# Altium project Steering_Unit_ECU.PrjPcb (part 1 of 2)
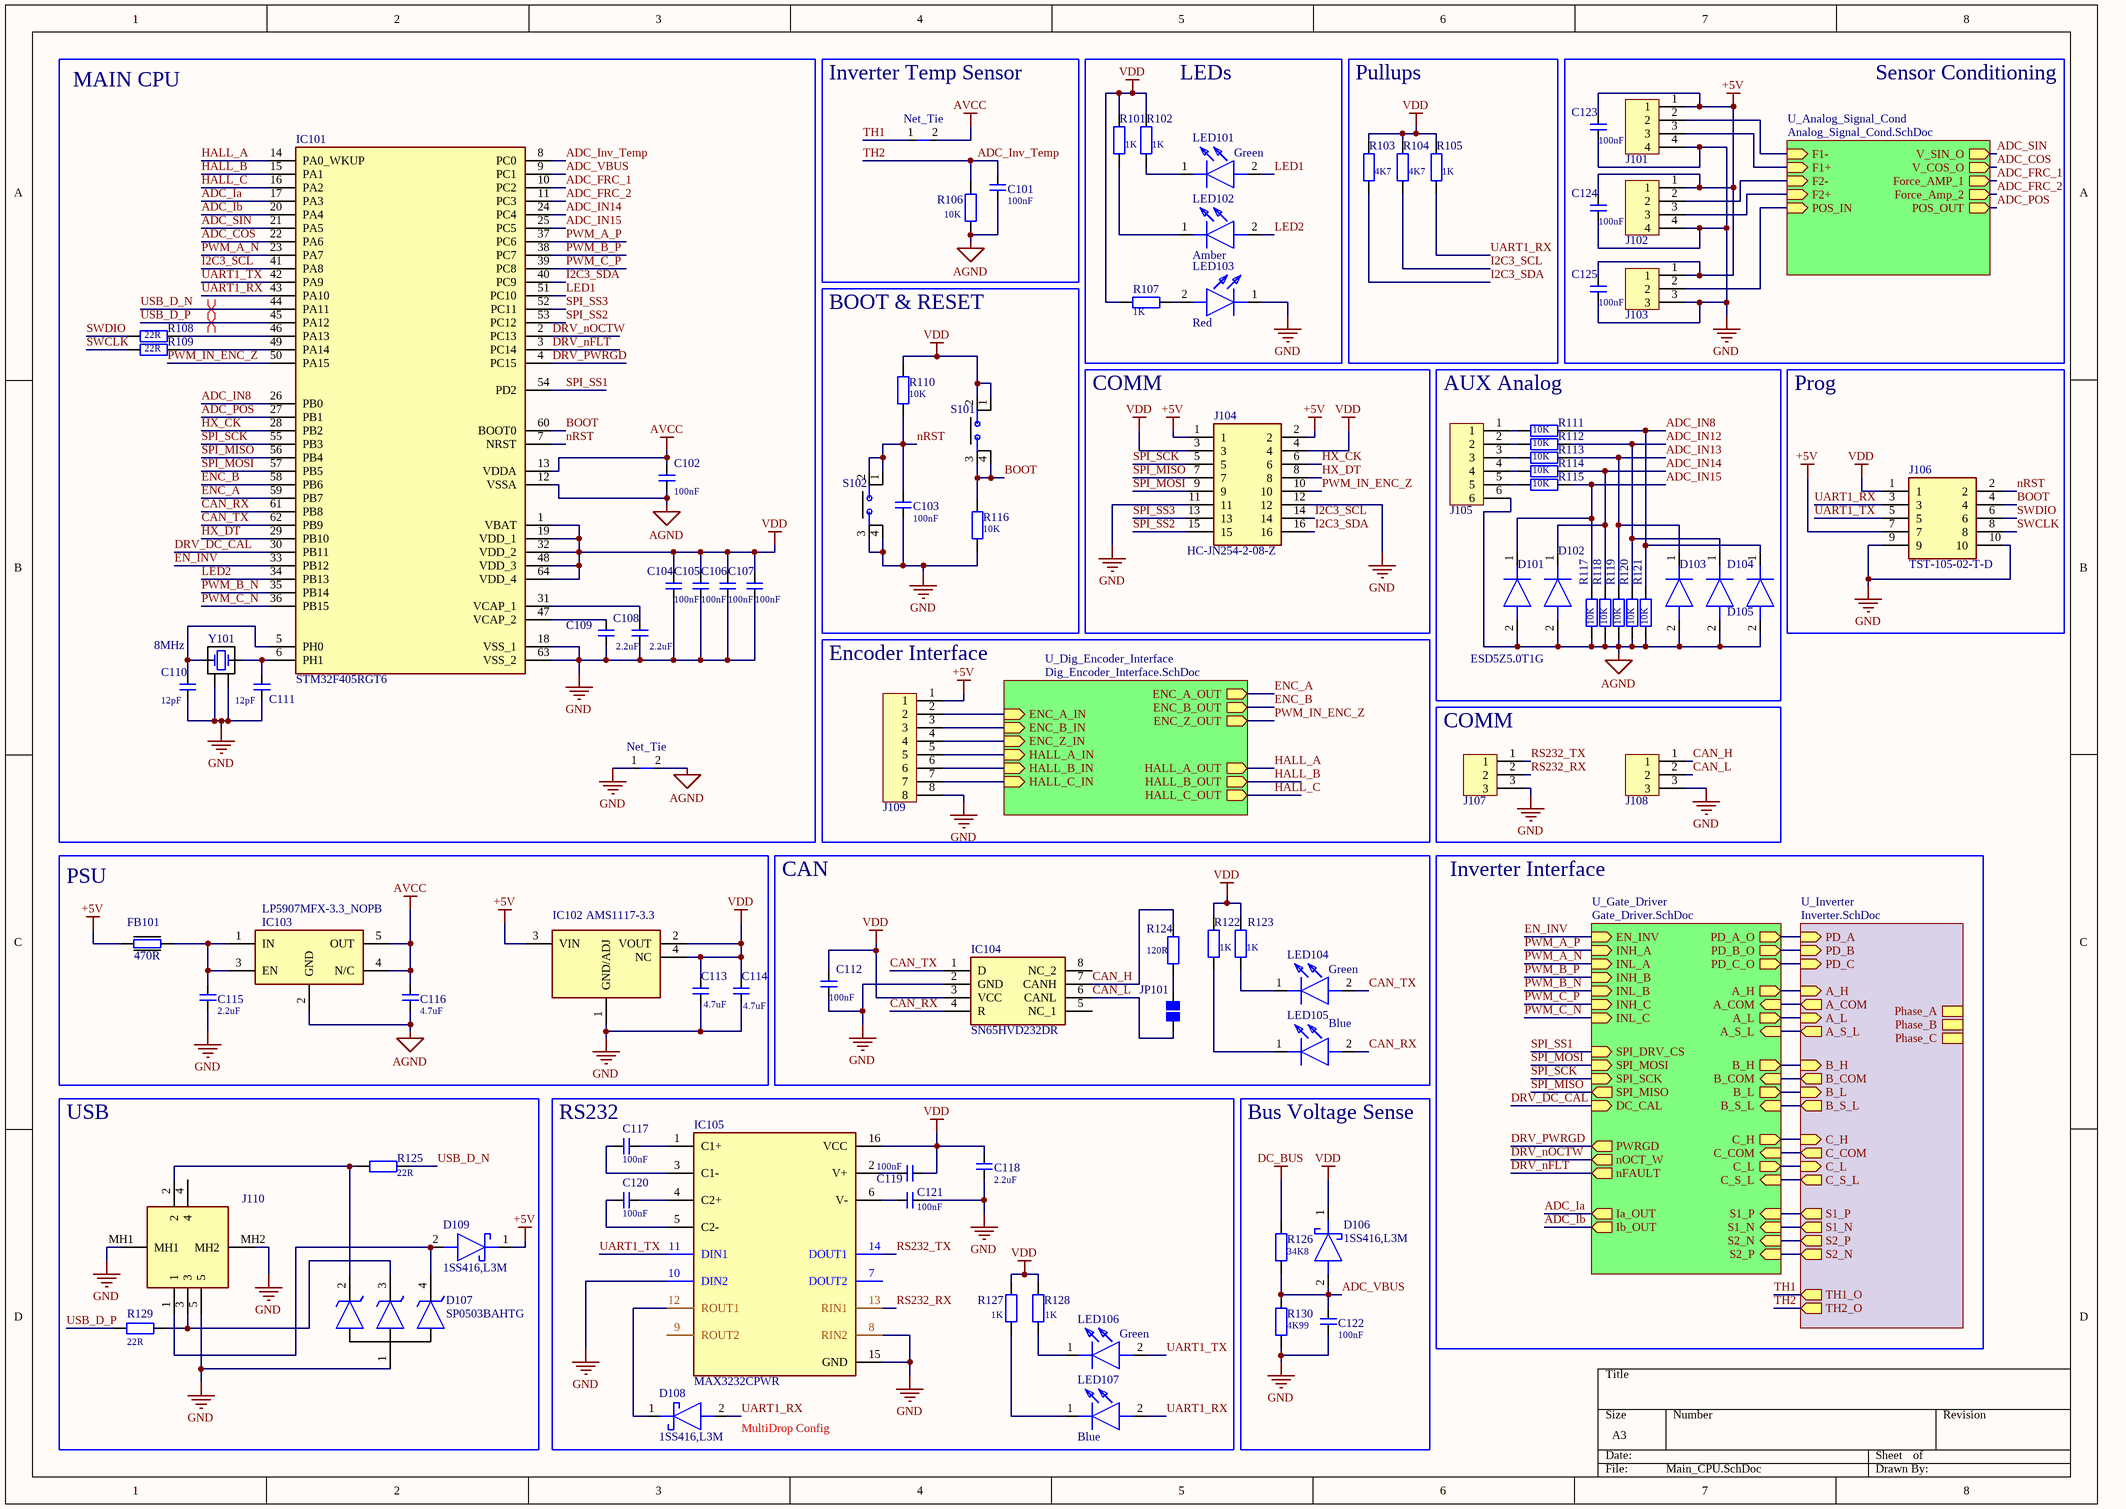
[diagram p0: Main_CPU.SchDoc]
5 sheets, 237 parts. Net scope: hierarchical (ports join the sheet entries above them; power ports are global).
Board file: ECU_Board.PcbDoc
Sheets:
  Main_CPU.SchDoc
    U_Gate_Driver = Gate_Driver.SchDoc
    U_Inverter = Inverter.SchDoc
    U_Dig_Encoder_Interface = Dig_Encoder_Interface.SchDoc
    U_Analog_Signal_Cond = Analog_Signal_Cond.SchDoc

## Sheet Main_CPU.SchDoc
size A3; DrawnBy: R.R.Sorial; SheetNumber: 1; SheetTotal: 5

### Parts
C101  value 100nF  [CAPC1005X06N]  (hidden comment: Cap)
C102  value 100nF  [CAPC1005X06N]  (hidden comment: Cap)
C103  value 100nF  [CAPC1005X06N]  (hidden comment: Cap)
C104  value 100nF  [CAPC1005X06N]  (hidden comment: Cap)
C105  value 100nF  [CAPC1005X06N]  (hidden comment: Cap)
C106  value 100nF  [CAPC1005X06N]  (hidden comment: Cap)
C107  value 100nF  [CAPC1005X06N]  (hidden comment: Cap)
C108  value 2.2uF  [CAPC1005X06N]  (hidden comment: Cap)
C109  value 2.2uF  [CAPC1005X06N]  (hidden comment: Cap)
C110  value 12pF  [CAPC1005X06N]  (hidden comment: Cap)
C111  value 12pF  [CAPC1005X06N]  (hidden comment: Cap)
C112  value 100nF  [CAPC1005X06N]  (hidden comment: Cap)
C113  value 4.7uF  [CAPC3225X17N]  (hidden comment: Cap)
C114  value 4.7uF  [CAPC3225X17N]  (hidden comment: Cap)
C115  value 2.2uF  [CAPC1005X06N]  (hidden comment: Cap)
C116  value 4.7uF  [CAPC3225X17N]  (hidden comment: Cap)
C117  value 100nF  [CAPC1005X06N]  (hidden comment: Cap)
C118  value 2.2uF  [CAPC1005X06N]  (hidden comment: Cap)
C119  value 100nF  [CAPC1005X06N]  (hidden comment: Cap)
C120  value 100nF  [CAPC1005X06N]  (hidden comment: Cap)
C121  value 100nF  [CAPC1005X06N]  (hidden comment: Cap)
C122  value 100nF  [CAPC1005X06N]  (hidden comment: Cap)
C123  value 100nF  [CAPC1005X06N]  (hidden comment: Cap)
C124  value 100nF  [CAPC1005X06N]  (hidden comment: Cap)
C125  value 100nF  [CAPC1005X06N]  (hidden comment: Cap)
D101  ESD5Z5.0T1G  [SODFL1608X70N]
D102  ESD5Z5.0T1G  [SODFL1608X70N]  (value not drawn)
D103  ESD5Z5.0T1G  [SODFL1608X70N]  (value not drawn)
D104  ESD5Z5.0T1G  [SODFL1608X70N]  (value not drawn)
D105  ESD5Z5.0T1G  [SODFL1608X70N]  (value not drawn)
D106  1SS416,L3M  [SODFL1006X45N]
D107  SP0503BAHTG  [SP0503BAHTG]
D108  1SS416,L3M  [SODFL1006X45N]
D109  1SS416,L3M  [SODFL1006X45N]
FB101  value 470R  [BLM18SP221SN1B]  (hidden comment: 470 OHM)
IC101  STM32F405RGT6  [QFP50P1200X1200X160-64N]
IC102  AMS1117-3.3  [SOT229P700X180-4N]
IC103  LP5907MFX-3.3_NOPB  [SOT95P280X145-5N]
IC104  SN65HVD232DR  [SOIC127P600X175-8N]
IC105  MAX3232CPWR  [SOP65P640X120-16N]
J101  XH2_54_4p  [XH2.54-4P]  (value not drawn)
J102  XH2_54_4p  [XH2.54-4P]  (value not drawn)
J103  XH2_54_3p  [XH2.54-3P]  (value not drawn)
J104  MPN: HC-JN254-2-08-Z  [SHDR16W64P254_2X8_2794X927X940P]  (hidden comment: TST-108-02-T-D)
J105  PCB_Conn_6P  [PCB_CONN_6]  (value not drawn)  (no BOM)
J106  TST-105-02-T-D  [TST-105-XX-Y-D]
J107  XH2_54_3p  [XH2.54-3P]  (value not drawn)
J108  XH2_54_3p  [XH2.54-3P]  (value not drawn)
J109  PCB_Conn_8p  [PCB_CONN_8]  (value not drawn)  (no BOM)
J110  10119313-301TLF  [10119313301TLF]  (value not drawn)
JP101  Jumper  [Jumper]  (value not drawn)  (no BOM)
LED101  Green  [LEDC1608X80N]
LED102  Amber  [LEDC1608X80N]
LED103  Red  [LEDC1608X80N]
LED104  Green  [LEDC1608X80N]
LED105  Blue  [LEDC1608X80N]
LED106  Green  [LEDC1608X80N]
LED107  Blue  [LEDC1608X80N]
NT101  Net_Tie  [Net_Tie_SMD]  (net tie, no BOM)
NT102  Net_Tie  [Net_Tie_SMD]  (net tie, no BOM)
R101  value 1K  [RESC1005X04N]  (hidden comment: R)
R102  value 1K  [RESC1005X04N]  (hidden comment: R)
R103  value 4K7  [RESC1005X04N]  (hidden comment: R)
R104  value 4K7  [RESC1005X04N]  (hidden comment: R)
R105  value 1K  [RESC1005X04N]  (hidden comment: R)
R106  value 10K  [RESC1005X04N]  (hidden comment: R)
R107  value 1K  [RESC1005X04N]  (hidden comment: R)
R108  value 22R  [RESC1005X04N]  (hidden comment: R)
R109  value 22R  [RESC1005X04N]  (hidden comment: R)
R110  value 10K  [RESC1005X04N]  (hidden comment: R)
R111  value 10K  [RESC1005X04N]  (hidden comment: R)
R112  value 10K  [RESC1005X04N]  (hidden comment: R)
R113  value 10K  [RESC1005X04N]  (hidden comment: R)
R114  value 10K  [RESC1005X04N]  (hidden comment: R)
R115  value 10K  [RESC1005X04N]  (hidden comment: R)
R116  value 10K  [RESC1005X04N]  (hidden comment: R)
R117  value 10K  [RESC1005X04N]  (hidden comment: R)
R118  value 10K  [RESC1005X04N]  (hidden comment: R)
R119  value 10K  [RESC1005X04N]  (hidden comment: R)
R120  value 10K  [RESC1005X04N]  (hidden comment: R)
R121  value 10K  [RESC1005X04N]  (hidden comment: R)
R122  value 1K  [RESC1005X04N]  (hidden comment: R)
R123  value 1K  [RESC1005X04N]  (hidden comment: R)
R124  value 120R  [RESC3216X06N]  (hidden comment: R)
R125  value 22R  [RESC1005X04N]  (hidden comment: R)
R126  value 34K8  [RESC1005X04N]  (hidden comment: R)
R127  value 1K  [RESC1005X04N]  (hidden comment: R)
R128  value 1K  [RESC1005X04N]  (hidden comment: R)
R129  value 22R  [RESC1005X04N]  (hidden comment: R)
R130  value 4K99  [RESC1005X04N]  (hidden comment: R)
S101  TS18-5-25-SL-260-SMT-TR  [TS18525SL260SMTTR]  (value not drawn)
S102  TS18-5-25-SL-260-SMT-TR  [TS18525SL260SMTTR]  (value not drawn)
Y101  value 8MHz  [830105863709]

### Blocks framed on the sheet
MAIN CPU: C102 C104-C111 IC101 NT101 R108 R109 Y101
Inverter Temp Sensor: C101 NT102 R106
LEDs: LED101-LED103 R101 R102 R107
Pullups: R103-R105
Sensor Conditioning: C123-C125 J101-J103
BOOT & RESET: C103 R110 R116 S101 S102
COMM: J104
AUX Analog: D101-D105 J105 R111-R115 R117-R121
Prog: J106
Encoder Interface: J109
COMM: J107 J108
PSU: C113-C116 FB101 IC102 IC103
CAN: C112 IC104 JP101 LED104 LED105 R122-R124
USB: D107 D109 J110 R125 R129
RS232: C117-C121 D108 IC105 LED106 LED107 R127 R128
Bus Voltage Sense: C122 D106 R126 R130

### Sub-sheets
U_Analog_Signal_Cond = Analog_Signal_Cond.SchDoc: V_SIN_O (out), V_COS_O (out), Force_AMP_1 (out), Force_Amp_2 (out), POS_OUT (out), F1- (in), F1+ (in), F2- (in), F2+ (in), POS_IN (in)
U_Dig_Encoder_Interface = Dig_Encoder_Interface.SchDoc: ENC_A_OUT (out), ENC_B_OUT (out), ENC_Z_OUT (out), HALL_A_OUT (out), HALL_B_OUT (out), HALL_C_OUT (out), ENC_A_IN (in), ENC_B_IN (in), ENC_Z_IN (in), HALL_A_IN (in), HALL_B_IN (in), HALL_C_IN (in)
U_Gate_Driver = Gate_Driver.SchDoc: EN_INV (in), INH_A (in), INL_A (in), INH_B (in), INL_B (in), INH_C (in), INL_C (in), SPI_DRV_CS (in), SPI_MISO (out), SPI_MOSI (in), SPI_SCK (in), DC_CAL (in), nOCT_W (out), nFAULT (out), S1_N (in), S1_P (in), S2_N (in), S2_P (in), A_H (out), A_L (out), A_COM (in), A_S_L (in), B_H (out), B_L (out), B_COM (in), B_S_L (in), C_H (out), C_L (out), C_COM (in), C_S_L (in), PWRGD (out), Ia_OUT (out), Ib_OUT (out), PD_A_O (out), PD_B_O (out), PD_C_O (out)
U_Inverter = Inverter.SchDoc: Phase_A, Phase_B, Phase_C, S1_P (out), S1_N (out), A_H (in), A_COM (out), A_L (in), A_S_L (out), S2_P (out), S2_N (out), B_H (in), B_COM (out), B_L (in), B_S_L (out), TH1_O (out), TH2_O (out), C_S_L (out), C_H (in), C_COM (out), C_L (in), PD_C (in), PD_A (in), PD_B (in)

### Nets
+5V: C123.2 C124.2 C125.2 D109.1(K) FB101.1 IC102.3(VIN) J101.1 J102.1 J103.1 J104.1 J104.2 J106.7 J109.1
AGND: C101.1 C102.1 C116.1 D101.2(A) D102.2(A) D103.2(A) D104.2(A) D105.2(A) IC101.12(VSSA) IC103.2(GND) J105.6 NT101.2 R106.1 R117.2 R118.2 R119.2 R120.2 R121.2
AVCC: C102.2 C116.2 IC101.13(VDDA) IC103.4(N/C) IC103.5(OUT) NT102.2
DC_BUS: R126.1
GND: C103.1 C104.1 C105.1 C106.1 C107.1 C108.1 C109.1 C110.1 C111.1 C112.1 C113.1 C114.1 C115.1 C118.1 C121.1 C122.1 C123.1 C124.1 C125.1 D107.1(A) IC101.18(VSS_1) IC101.63(VSS_2) IC102.1(GND/ADJ) IC104.2(GND) IC105.8(RIN2) IC105.10(DIN2) IC105.15(GND) J101.4 J102.4 J103.3 J104.11 J104.12 J106.9 J106.10 J107.3 J108.3 J109.8 J110.5 J110.MH1 J110.MH2 LED103.1(K) NT101.1 R116.1 R130.2 S102.3(COM_1) S102.4(COM_2) Y101.2(GND_&_LID_1) Y101.4(GND_&_LID_2)
VDD: C104.2 C105.2 C106.2 C107.2 C112.2 C113.2 C114.2 C118.2 C119.1 D106.1(K) IC101.1(VBAT) IC101.19(VDD_1) IC101.32(VDD_2) IC101.48(VDD_3) IC101.64(VDD_4) IC102.2(VOUT) IC102.4(NC) IC104.3(VCC) IC105.16(VCC) J104.3 J104.4 J106.1 R101.1 R102.1 R103.1 R104.1 R105.1 R107.2 R110.2 R122.2 R123.2 R127.2 R128.2 S101.1(NO_1) S101.2(NO_2)
A_COM: sheet U_Gate_Driver/A_COM, sheet U_Inverter/A_COM
A_HIGH: sheet U_Gate_Driver/A_H, sheet U_Inverter/A_H
A_LOW: sheet U_Gate_Driver/A_L, sheet U_Inverter/A_L
A_S_L: sheet U_Gate_Driver/A_S_L, sheet U_Inverter/A_S_L
ADC_COS: IC101.22(PA6) ; sheet U_Analog_Signal_Cond/V_COS_O
ADC_FRC_1: IC101.10(PC2) ; sheet U_Analog_Signal_Cond/Force_AMP_1
ADC_FRC_2: IC101.11(PC3) ; sheet U_Analog_Signal_Cond/Force_Amp_2
ADC_Ia: IC101.17(PA3) ; sheet U_Gate_Driver/Ia_OUT
ADC_Ib: IC101.20(PA4) ; sheet U_Gate_Driver/Ib_OUT
ADC_IN8: D105.1(K) IC101.26(PB0) R111.1 R121.1
ADC_IN12: D104.1(K) R112.1 R120.1
ADC_IN13: D103.1(K) R113.1 R119.1
ADC_IN14: D102.1(K) IC101.24(PC4) R114.1 R118.1
ADC_IN15: D101.1(K) IC101.25(PC5) R115.1 R117.1
ADC_Inv_Temp: C101.2 IC101.8(PC0) R106.2 ; sheet U_Inverter/TH2_O  [also labelled TH2]
ADC_POS: IC101.27(PB1) ; sheet U_Analog_Signal_Cond/POS_OUT
ADC_SIN: IC101.21(PA5) ; sheet U_Analog_Signal_Cond/V_SIN_O
ADC_VBUS: C122.2 D106.2(A) IC101.9(PC1) R126.2 R130.1
B_COM: sheet U_Gate_Driver/B_COM, sheet U_Inverter/B_COM
B_HIGH: sheet U_Gate_Driver/B_H, sheet U_Inverter/B_H
B_LOW: sheet U_Gate_Driver/B_L, sheet U_Inverter/B_L
B_SRC_LOW: sheet U_Gate_Driver/B_S_L, sheet U_Inverter/B_S_L
BOOT: IC101.60(BOOT0) J106.4 R116.2 S101.3(COM_1) S101.4(COM_2)
C_COM: sheet U_Gate_Driver/C_COM, sheet U_Inverter/C_COM
C_HIGH: sheet U_Gate_Driver/C_H, sheet U_Inverter/C_H
C_LOW: sheet U_Gate_Driver/C_L, sheet U_Inverter/C_L
C_SRC_LOW: sheet U_Gate_Driver/C_S_L, sheet U_Inverter/C_S_L
CAN_H: IC104.7(CANH) J108.1 R124.2
CAN_L: IC104.6(CANL) J108.2 JP101.1
CAN_RX: IC101.61(PB8) IC104.4(R) LED105.2(A)
CAN_TX: IC101.62(PB9) IC104.1(D) LED104.2(A)
DRV_DC_CAL: IC101.30(PB11) ; sheet U_Gate_Driver/DC_CAL
DRV_nFLT: IC101.3(PC14) ; sheet U_Gate_Driver/nFAULT
DRV_nOCTW: IC101.2(PC13) ; sheet U_Gate_Driver/nOCT_W
DRV_PWRGD: IC101.4(PC15) ; sheet U_Gate_Driver/PWRGD
EN_INV: IC101.33(PB12) ; sheet U_Gate_Driver/EN_INV
ENC_A: IC101.59(PB7) ; sheet U_Dig_Encoder_Interface/ENC_A_OUT
ENC_B: IC101.58(PB6) ; sheet U_Dig_Encoder_Interface/ENC_B_OUT
HALL_A: IC101.14(PA0_WKUP) ; sheet U_Dig_Encoder_Interface/HALL_A_OUT
HALL_B: IC101.15(PA1) ; sheet U_Dig_Encoder_Interface/HALL_B_OUT
HALL_C: IC101.16(PA2) ; sheet U_Dig_Encoder_Interface/HALL_C_OUT
HX_CK: IC101.28(PB2) J104.6
HX_DT: IC101.29(PB10) J104.8
I2C3_SCL: IC101.41(PA8) J104.14 R104.2
I2C3_SDA: IC101.40(PC9) J104.16 R103.2
LED1: IC101.51(PC10) LED101.2(A)
LED2: IC101.34(PB13) LED102.2(A)
nRST: C103.2 IC101.7(NRST) J106.2 R110.1 S102.1(NO_1) S102.2(NO_2)
P_DISC_A: sheet U_Gate_Driver/PD_A_O, sheet U_Inverter/PD_A
P_DISC_C: sheet U_Gate_Driver/PD_C_O, sheet U_Inverter/PD_C
PDISC_B: sheet U_Gate_Driver/PD_B_O, sheet U_Inverter/PD_B
PWM_A_N: IC101.23(PA7) ; sheet U_Gate_Driver/INL_A
PWM_A_P: IC101.37(PC6) ; sheet U_Gate_Driver/INH_A
PWM_B_N: IC101.35(PB14) ; sheet U_Gate_Driver/INL_B
PWM_B_P: IC101.38(PC7) ; sheet U_Gate_Driver/INH_B
PWM_C_N: IC101.36(PB15) ; sheet U_Gate_Driver/INL_C
PWM_C_P: IC101.39(PC8) ; sheet U_Gate_Driver/INH_C
PWM_IN_ENC_Z: IC101.50(PA15) J104.10 ; sheet U_Dig_Encoder_Interface/ENC_Z_OUT
RS232_RX: IC105.13(RIN1) J107.2
RS232_TX: IC105.14(DOUT1) J107.1
S1_N: sheet U_Gate_Driver/S1_N, sheet U_Inverter/S1_N
S1_P: sheet U_Gate_Driver/S1_P, sheet U_Inverter/S1_P
S2_N: sheet U_Gate_Driver/S2_P, sheet U_Inverter/S2_N
S2_P: sheet U_Gate_Driver/S2_N, sheet U_Inverter/S2_P
SPI_MISO: IC101.56(PB4) J104.7 ; sheet U_Gate_Driver/SPI_MISO
SPI_MOSI: IC101.57(PB5) J104.9 ; sheet U_Gate_Driver/SPI_MOSI
SPI_SCK: IC101.55(PB3) J104.5 ; sheet U_Gate_Driver/SPI_SCK
SPI_SS1: IC101.54(PD2) ; sheet U_Gate_Driver/SPI_DRV_CS
SPI_SS2: IC101.53(PC12) J104.15
SPI_SS3: IC101.52(PC11) J104.13
SWCLK: J106.8 R109.2
SWDIO: J106.6 R108.2
TH1: NT102.1 ; sheet U_Inverter/TH1_O
UART1_RX: D108.2(A) IC101.43(PA10) J106.3 LED107.2(A) R105.2
UART1_TX: IC101.42(PA9) IC105.11(DIN1) J106.5 LED106.2(A)
USB_D_N: IC101.44(PA11) R125.1
USB_D_P: IC101.45(PA12) R129.2
NetC108_2: C108.2 IC101.31(VCAP_1)
NetC109_2: C109.2 IC101.47(VCAP_2)
NetC110_2: C110.2 IC101.5(PH0) Y101.1(CRYSTAL__1)
NetC111_2: C111.2 IC101.6(PH1) Y101.3(CRYSTAL__2)
NetC115_2: C115.2 FB101.2 IC103.1(IN) IC103.3(EN)
NetC117_1: C117.1 IC105.1(C1+)
NetC117_2: C117.2 IC105.3(C1-)
NetC119_2: C119.2 IC105.2(V+)
NetC120_1: C120.1 IC105.4(C2+)
NetC120_2: C120.2 IC105.5(C2-)
NetC121_2: C121.2 IC105.6(V-)
NetD107_2: D107.2(K) J110.2 R125.2
NetD107_3: D107.3(K) J110.3 R129.1
NetD107_4: D107.4(K) D109.2(A) J110.1
NetD108_1: D108.1(K) IC105.12(ROUT1)
NetD301_1: J103.2 ; sheet U_Analog_Signal_Cond/POS_IN
NetIC101_46: IC101.46(PA13) R108.1
NetIC101_49: IC101.49(PA14) R109.1
NetIC301_2: J101.2 ; sheet U_Analog_Signal_Cond/F1-
NetIC301_3: J101.3 ; sheet U_Analog_Signal_Cond/F1+
NetIC303_2: J102.2 ; sheet U_Analog_Signal_Cond/F2-
NetIC303_3: J102.3 ; sheet U_Analog_Signal_Cond/F2+
NetJ105_1: J105.1 R111.2
NetJ105_2: J105.2 R112.2
NetJ105_3: J105.3 R113.2
NetJ105_4: J105.4 R114.2
NetJ105_5: J105.5 R115.2
NetJ109_2: J109.2 ; sheet U_Dig_Encoder_Interface/ENC_A_IN
NetJ109_3: J109.3 ; sheet U_Dig_Encoder_Interface/ENC_B_IN
NetJ109_4: J109.4 ; sheet U_Dig_Encoder_Interface/ENC_Z_IN
NetJ109_5: J109.5 ; sheet U_Dig_Encoder_Interface/HALL_A_IN
NetJ109_6: J109.6 ; sheet U_Dig_Encoder_Interface/HALL_B_IN
NetJ109_7: J109.7 ; sheet U_Dig_Encoder_Interface/HALL_C_IN
NetJP101_2: JP101.2 R124.1
NetLED101_1: LED101.1(K) R102.2
NetLED102_1: LED102.1(K) R101.2
NetLED103_2: LED103.2(A) R107.1
NetLED104_1: LED104.1(K) R123.1
NetLED105_1: LED105.1(K) R122.1
NetLED106_1: LED106.1(K) R128.1
NetLED107_1: LED107.1(K) R127.1

Not connected (* = marked no-connect by the designer): IC104 5(NC_1) 8(NC_2); IC105 7(DOUT2) 9(ROUT2); J110 4

### Layout directives
differential pair: USB_D_N, USB_D_P

### Notes on the sheet
- Inverter Interface
- (near D108) MultiDrop Config

### Library data of the parts
C101-C107 C112 C117 C119-C125 = Cap: Capacitor; MPN: GCM155R71H104KE02D; Link: https://jlcpcb.com/partdetail/MurataElectronics-GCM155R71H104KE02D/C85858; Price: 0.0031
C108 C109 C115 C118 = Cap: Capacitor; MPN: GRM155Z71A225KE44D; Link: https://jlcpcb.com/partdetail/3478404-GRM155Z71A225KE44D/C2999759; Price: 0.0332
C110 C111 = Cap: Capacitor; MPN: GRM1555C1H120JA01D; Link: https://jlcpcb.com/partdetail/MurataElectronics-GRM1555C1H120JA01D/C76948; Price: 0.0028
C113 C114 C116 = Cap: Capacitor; MPN: CC1210KKX7R8BB475; Link: https://www.lcsc.com/product-detail/Multilayer-Ceramic-Capacitors-MLCC-SMD-SMT_YAGEO-CC1210KKX7R8BB475_C2980104.html; Price: 0.1519
D101 D105 = ESD5Z5.0T1G: Diode; Manufacturer_Name: onsemi; Datasheet Link: http://www.onsemi.com/pub/Collateral/ESD5Z2.5T1-D.PDF; Height: 0.7mm; Mouser Part Number: 863-ESD5Z5.0T1G; Mouser Price/Stock: https://www.mouser.co.uk/ProductDetail/onsemi/ESD5Z5.0T1G?qs=OSf9jACorvYw3fDx1S8P6A%3D%3D; Arrow Part Number: ESD5Z5.0T1G; Arrow Price/Stock: https://www.arrow.com/en/products/esd5z5.0t1g/on-semiconductor?utm_currency=USD&region=nac; MPN: ESD5Z5.0T1G
  D101: ComponentLink1Description: New link; ComponentLink1URL: *; link: https://www.lcsc.com/product-detail/ESD-and-Surge-Protection-TVS-ESD_BORN-ESD5Z5-0T1G_C343989.html?s_z=n_ESD5Z5.0T1G
  D105: limk: https://www.lcsc.com/product-detail/ESD-and-Surge-Protection-TVS-ESD_BORN-ESD5Z5-0T1G_C343989.html?s_z=n_ESD5Z5.0T1G
D102-D104 = ESD5Z5.0T1G: Diode; Manufacturer_Name: onsemi; MPN: 863-ESD5Z5.0T1G; Datasheet Link: http://www.onsemi.com/pub/Collateral/ESD5Z2.5T1-D.PDF; Height: 0.7mm; Mouser Price/Stock: https://www.mouser.co.uk/ProductDetail/onsemi/ESD5Z5.0T1G?qs=OSf9jACorvYw3fDx1S8P6A%3D%3D; Arrow Part Number: ESD5Z5.0T1G; Arrow Price/Stock: https://www.arrow.com/en/products/esd5z5.0t1g/on-semiconductor?utm_currency=USD&region=nac; Manufacturer_Part_Number: ESD5Z5.0T1G; link: https://www.lcsc.com/product-detail/ESD-and-Surge-Protection-TVS-ESD_BORN-ESD5Z5-0T1G_C343989.html?s_z=n_ESD5Z5.0T1G
D106 D108 D109 = 1SS416,L3M: Schottky Diode; Manufacturer_Name: Toshiba; MPN: 1SS416,L3M(B; Datasheet Link: http://toshiba.semicon-storage.com/info/docget.jsp?did=344&prodName=1SS416; Height: 0.45mm; Mouser Part Number: 757-1SS416L3M; Mouser Price/Stock: https://www.mouser.co.uk/ProductDetail/Toshiba/1SS416L3M?qs=G9o9YCnxvoYU%252BWabcXJZJg%3D%3D; Arrow Part Number: 1SS416,L3M; Arrow Price/Stock: https://www.arrow.com/en/products/1ss416l3m/toshiba?region=nac; Link: https://www.lcsc.com/product-detail/Schottky-Diodes_TOSHIBA-1SS416-L3M-B_C2943683.html; Price: 0.0251
D107 = SP0503BAHTG: TVS Diode (Uni-directional); Manufacturer_Name: LITTELFUSE; Datasheet Link: https://nl.mouser.com/datasheet/2/240/Littelfuse_TVS_Diode_Array_SP05_Datasheet.pdf-777043.pdf; Height: 1.22mm; MPN: SP0503BAHTG; Mouser Part Number: 576-SP0503BAHTG; Mouser Price/Stock: https://www.mouser.co.uk/ProductDetail/Littelfuse/SP0503BAHTG?qs=uD%2FdkN7XIa0NTYXwHdELYA%3D%3D; Arrow Part Number: SP0503BAHTG; Arrow Price/Stock: https://www.arrow.com/en/products/sp0503bahtg/littelfuse?region=nac; Link: https://www.lcsc.com/product-detail/ESD-and-Surge-Protection-TVS-ESD_Littelfuse-SP0503BAHTG_C7074.html; Price: 0.1508
FB101 = BLM18KG471SN1D: Ferrite Bead; Manufacturer_Name: Murata Electronics; Datasheet Link: http://www.murata.com/~/media/webrenewal/support/library/catalog/products/emc/emifil/c31e.ashx?la=en-gb; Height: 0.95mm; MPN: BLM18KG471SN1D; Mouser Part Number: 81-BLM18KG471SN1D; Mouser Price/Stock: https://www.mouser.co.uk/ProductDetail/Murata-Electronics/BLM18KG471SN1D?qs=rvfpa0%252BU10NIg0zs9veElg%3D%3D; Arrow Part Number: BLM18KG471SN1D; Arrow Price/Stock: https://www.arrow.com/en/products/blm18kg471sn1d/murata-manufacturing?region=europe; Link: https://www.lcsc.com/product-detail/Ferrite-Beads_Murata-Electronics-BLM18KG471SN1D_C413961.html
IC101 = STM32F405RGT6: Integrated Circuit; Manufacturer_Name: STMicroelectronics; Datasheet Link: http://www.st.com/web/en/resource/technical/document/datasheet/DM00037051.pdf; Height: 1.6mm; MPN: STM32F405RGT6; Mouser Part Number: 511-STM32F405RGT6; Mouser Price/Stock: https://www.mouser.co.uk/ProductDetail/STMicroelectronics/STM32F405RGT6?qs=Z8%252BeY1k3TIKgj7QWsYGpQw%3D%3D; Arrow Part Number: STM32F405RGT6; Arrow Price/Stock: https://www.arrow.com/en/products/stm32f405rgt6/stmicroelectronics?utm_currency=USD&region=nac; Link: https://www.lcsc.com/product-detail/Microcontrollers-MCU-MPU-SOC_STMicroelectronics-STM32F405RGT6_C15742.html; Price: 2.6733
IC102 = AMS1117-3.3: Integrated Circuit; Manufacturer_Name: Advanced; Datasheet Link: https://datasheet.datasheetarchive.com/originals/distributors/Datasheets-28/DSA-550594.pdf; Height: 1.8mm; MPN: AMS1117-3.3; Link: https://www.lcsc.com/product-detail/Voltage-Regulators-Linear-Low-Drop-Out-LDO-Regulators_Advanced-Monolithic-Systems-AMS1117-3-3_C6186.html; Price: 0.1342
IC103 = LP5907MFX-3.3_NOPB: Integrated Circuit; Manufacturer_Name: Texas Instruments; MPN: LP5907MFX-3.3/NOPB; Datasheet Link: https://datasheet.datasheetarchive.com/originals/distributors/Datasheets-SFU2/DSASFU100037200.pdf; Height: 1.45mm; Mouser Part Number: 595-LP5907MFX-3.3NPB; Mouser Price/Stock: https://www.mouser.co.uk/ProductDetail/Texas-Instruments/LP5907MFX-3.3-NOPB?qs=biyDIajrTn6NhrJCoL%2FdSQ%3D%3D; Arrow Part Number: LP5907MFX-3.3/NOPB; Arrow Price/Stock: https://www.arrow.com/en/products/lp5907mfx-3.3nopb/texas-instruments?utm_currency=USD&region=nac; Link: https://www.lcsc.com/product-detail/Voltage-Regulators-Linear-Low-Drop-Out-LDO-Regulators_Texas-Instruments-LP5907MFX-3-3-NOPB_C80670.html; Price: 0.1083
IC104 = SN65HVD232DR: Integrated Circuit; Manufacturer_Name: Texas Instruments; Datasheet Link: http://www.ti.com/lit/gpn/sn65hvd232; Height: 1.75mm; MPN: SN65HVD232DR; Mouser Price/Stock: https://www.mouser.co.uk/ProductDetail/Texas-Instruments/SN65HVD232DR?qs=QViXGNcIEAtY%252BrViRMr46w%3D%3D; Arrow Part Number: SN65HVD232DR; Arrow Price/Stock: https://www.arrow.com/en/products/sn65hvd232dr/texas-instruments?region=nac; Link: https://www.lcsc.com/product-detail/CAN-Transceivers_Texas-Instruments-SN65HVD232DR_C30530.html; Price: 0.4813
IC105 = MAX3232CPWR: Integrated Circuit; Manufacturer_Name: Texas Instruments; Datasheet Link: http://www.ti.com/lit/gpn/max3232; Height: 1.2mm; MPN: MAX3232CPWR; Mouser Price/Stock: https://www.mouser.co.uk/ProductDetail/Texas-Instruments/MAX3232CPWR?qs=bkMXpVdiF40tDMAEI%2F4vWA%3D%3D; Arrow Part Number: MAX3232CPWR; Arrow Price/Stock: https://www.arrow.com/en/products/max3232cpwr/texas-instruments?region=nac; Link: https://www.lcsc.com/product-detail/RS232-ICs_Texas-Instruments-MAX3232CPWR_C428620.html; Price: 0.4166
J101 J102 = XH2_54_4p: MPN: BX-XH2.54-4PZZ; Link: https://www.lcsc.com/product-detail/Wire-To-Board-Connector_Bossie-BX-XH2-54-4PZZ_C18077835.html; Price: 0.0185
J103 J107 J108 = XH2_54_3p: MPN: ZX-XH2.54-3PZZ; Link: https://www.lcsc.com/product-detail/Wire-To-Board-Connector_Megastar-ZX-XH2-54-3PZZ_C7429633.html; Price: 0.0073
J104 = TST-108-02-T-D: Connector; Mouser Part Number: 200-TST10802TD; Mouser Price/Stock: https://www.mouser.co.uk/ProductDetail/Samtec/TST-108-02-T-D?qs=rU5fayqh%252BE1iZn2yp3BQ2w%3D%3D; Arrow Part Number: TST-108-02-T-D; Arrow Price/Stock: https://www.arrow.com/en/products/tst-108-02-t-d/samtec?region=nac; Link: https://www.lcsc.com/product-detail/IDC-Connectors_HCTL-HC-JN254-2-08-Z_C5372867.html; Price: 0.0987
J106 = TST-105-02-T-D: Connector; Manufacturer_Name: SAMTEC; MPN: ZX-IDC2.54-2-5PZZ; Datasheet Link: http://suddendocs.samtec.com/prints/tst-1xx-xx-x-x-xx-xx-mkt.pdf; Mouser Part Number: 200-TST10502TD; Mouser Price/Stock: https://www.mouser.co.uk/ProductDetail/Samtec/TST-105-02-T-D?qs=rU5fayqh%252BE1w4XXP0IOe8w%3D%3D; Arrow Part Number: TST-105-02-T-D; Arrow Price/Stock: https://www.arrow.com/en/products/tst-105-02-t-d/samtec?region=nac; Link: https://www.lcsc.com/product-detail/IDC-Connectors_Megastar-ZX-IDC2-54-2-5PZZ_C7501191.html?s_z=n_IDC%20Connector; Price: 0.1126
J110 = 10119313-301TLF: Connector; Manufacturer_Name: Amphenol; MPN: HX MINI5P T; Datasheet Link: https://cdn.amphenol-cs.com/media/wysiwyg/files/drawing/10119313.pdf; Height: 9.7mm; Mouser Part Number: 649-10119313-301TLF; Mouser Price/Stock: https://www.mouser.co.uk/ProductDetail/Amphenol-FCI/10119313-301TLF?qs=QcFhgjUTvvrAeUuachPUXg%3D%3D; link: https://www.lcsc.com/product-detail/USB-Connectors_hanxia-HX-MINI5P-T_C19189146.html
LED101 LED104 LED106 = 150060SS75000: LED; Manufacturer_Name: Wurth Elektronik; MPN: XL-1608UGC-04; Height: 0.8mm; Mouser Part Number: 710-150060SS75000; Mouser Price/Stock: https://www.mouser.co.uk/ProductDetail/Wurth-Elektronik/150060SS75000?qs=LlUlMxKIyB0oQaxwspeTEA%3D%3D; Price: 0.0041; Link: https://www.lcsc.com/product-detail/LED-Indication-Discrete_XINGLIGHT-XL-1608UGC-04_C965804.html
LED102 = 150060SS75000: LED; Manufacturer_Name: Wurth Elektronik; MPN: 19-217UYOC/S3112/TR8; Height: 0.8mm; Mouser Part Number: 710-150060SS75000; Mouser Price/Stock: https://www.mouser.co.uk/ProductDetail/Wurth-Elektronik/150060SS75000?qs=LlUlMxKIyB0oQaxwspeTEA%3D%3D; Price: 0.0247; Link: https://www.lcsc.com/product-detail/LED-Indication-Discrete_Everlight-Elec-19-217UYOC-S3112-TR8_C264473.html
LED103 = 150060SS75000: LED; Manufacturer_Name: Wurth Elektronik; MPN: XL-1608SURC-06; Height: 0.8mm; Mouser Part Number: 710-150060SS75000; Mouser Price/Stock: https://www.mouser.co.uk/ProductDetail/Wurth-Elektronik/150060SS75000?qs=LlUlMxKIyB0oQaxwspeTEA%3D%3D; Price: 0.003; Link: https://www.lcsc.com/product-detail/LED-Indication-Discrete_XINGLIGHT-XL-1608SURC-06_C965799.html
LED105 LED107 = 150060SS75000: LED; Manufacturer_Name: Wurth Elektronik; MPN: XL-1608UBC-04; Height: 0.8mm; Mouser Part Number: 710-150060SS75000; Mouser Price/Stock: https://www.mouser.co.uk/ProductDetail/Wurth-Elektronik/150060SS75000?qs=LlUlMxKIyB0oQaxwspeTEA%3D%3D; Price: 0.0033; Link: https://www.lcsc.com/product-detail/LED-Indication-Discrete_XINGLIGHT-XL-1608UBC-04_C965807.html
NT101 NT102 = Net_Tie: Net Tie
R101 R102 R105 R107 R122 R123 R127 R128 = R: Resistor; MPN: RC0402FR-071KL; Link: RC0402FR-071KL; Price: 0.0006
R103 R104 = R: Resistor; MPN: RC0402FR-074K7L; Link: https://jlcpcb.com/partdetail/Yageo-RC0402FR074K7L/C105871; Price: 0.0006
R106 R110-R121 = R: Resistor; MPN: RC0402FR-0710KL; Link: https://jlcpcb.com/partdetail/Yageo-RC0402FR0710KL/C60490; Price: 0.0005
R108 R109 R125 R129 = R: Resistor; MPN: RC0402FR-0722RL; Link: https://jlcpcb.com/partdetail/Yageo-RC0402FR0722RL/C114765; Price: 0.0006
R124 = R: Resistor; MPN: RC1206FR-07120RL; Link: https://www.lcsc.com/product-detail/Chip-Resistor-Surface-Mount_YAGEO-RC1206FR-07120RL_C114928.html; Price: 0.0036
R126 = R: Resistor; MPN: RC0402FR-0734K8L; Link: https://jlcpcb.com/partdetail/Yageo-RC0402FR0734K8L/C327350; Price: 0.0006
R130 = R: Resistor; MPN: RC0402FR-074K99L; Link: https://jlcpcb.com/partdetail/Yageo-RC0402FR074K99L/C137965; Price: 0.0006
S101 S102 = TS18-5-25-SL-260-SMT-TR: Switch; Manufacturer_Name: Same Sky; MPN: GT-TC084B-H015-L5; Datasheet Link: https://www.sameskydevices.com/product/resource/supplyframepdf/ts18.pdf; Height: 2.7mm; Mouser Part Number: 179-TS18525SL260SMTT; Mouser Price/Stock: https://www.mouser.co.uk/ProductDetail/Same-Sky/TS18-5-25-SL-260-SMT-TR?qs=tlsG%2FOw5FFh0yS4gYnfcwg%3D%3D; Link: https://www.lcsc.com/product-detail/Tactile-Switches_G-Switch-GT-TC084B-H015-L5_C778173.html; Price: 0.049
Y101 = XTAL_3225: Crystal or Oscillator; Manufacturer_Name: Wurth Elektronik; MPN: XL2EL89COI-111YLC-8M; Datasheet Link: https://www.we-online.com/catalog/datasheet/830105863709.pdf; Height: 0.8mm; Mouser Part Number: 710-830105863709; Mouser Price/Stock: https://www.mouser.co.uk/ProductDetail/Wurth-Elektronik/830105863709?qs=hd1VzrDQEGgXVxZIC%252BUALw%3D%3D; Link: https://www.lcsc.com/product-detail/Crystals_YXC-Crystal-Oscillators-XL2EL89COI-111YLC-8M_C2973805.html; Price: 0.115

## Sheet Gate_Driver.SchDoc
size A4; CompanyName: I-MTEC; DrawnBy: R.R.Sorial; SheetNumber: 3; SheetTotal: 5
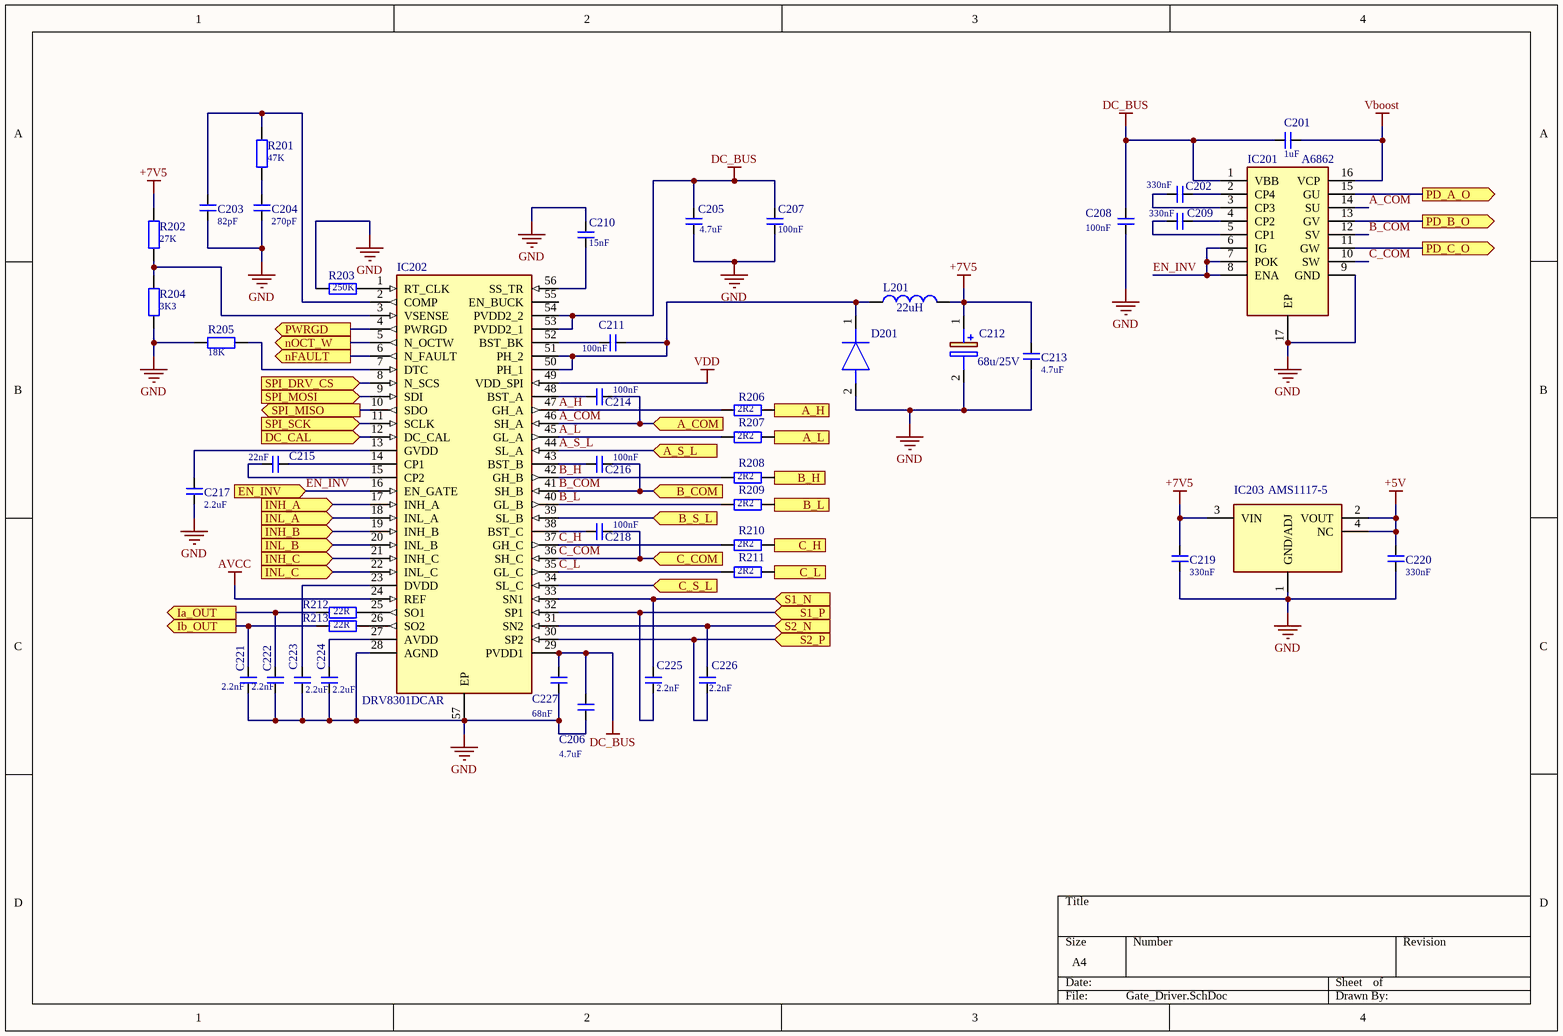
[diagram p1: Gate_Driver.SchDoc]

### Parts
C201  value 1uF  [CAPC1005X06N]  (hidden comment: Cap)
C202  value 330nF  [CAPC1005X06N]  (hidden comment: Cap)
C203  value 82pF  [CAPC1005X06N]  (hidden comment: Cap)
C204  value 270pF  [CAPC1005X06N]  (hidden comment: Cap)
C205  value 4.7uF  [CAPC3225X17N]  (hidden comment: Cap)
C206  value 4.7uF  [CAPC3225X17N]  (hidden comment: Cap)
C207  value 100nF  [CAPC1005X06N]  (hidden comment: Cap)
C208  value 100nF  [CAPC1005X06N]  (hidden comment: Cap)
C209  value 330nF  [CAPC1005X06N]  (hidden comment: Cap)
C210  value 15nF  [CAPC1005X06N]  (hidden comment: Cap)
C211  value 100nF  [CAPC1005X06N]  (hidden comment: Cap)
C212  68u/25V  [EEE0GA101SR]
C213  value 4.7uF  [CAPC3225X17N]  (hidden comment: Cap)
C214  value 100nF  [CAPC1005X06N]  (hidden comment: Cap)
C215  value 22nF  [CAPC1005X06N]  (hidden comment: Cap)
C216  value 100nF  [CAPC1005X06N]  (hidden comment: Cap)
C217  value 2.2uF  [CAPC1005X06N]  (hidden comment: Cap)
C218  value 100nF  [CAPC1005X06N]  (hidden comment: Cap)
C219  value 330nF  [CAPC1005X06N]  (hidden comment: Cap)
C220  value 330nF  [CAPC1005X06N]  (hidden comment: Cap)
C221  value 2.2nF  [CAPC1005X06N]  (hidden comment: Cap)
C222  value 2.2nF  [CAPC1005X06N]  (hidden comment: Cap)
C223  value 2.2uF  [CAPC1005X06N]  (hidden comment: Cap)
C224  value 2.2uF  [CAPC1005X06N]  (hidden comment: Cap)
C225  value 2.2nF  [CAPC1005X06N]  (hidden comment: Cap)
C226  value 2.2nF  [CAPC1005X06N]  (hidden comment: Cap)
C227  value 68nF  [CAPC1005X06N]  (hidden comment: Cap)
D201  MBR140SFT3G  [SODFL3616X98N]  (value not drawn)
IC201  A6862  [SOP65P640X120-17N]
IC202  DRV8301DCAR  [SOP50P810X120-57N]
IC203  AMS1117-5  [SOT229P700X180-4N]
L201  value 22uH  [INDP6060X30N]  (hidden comment: L)
R201  value 47K  [RESC1005X04N]  (hidden comment: R)
R202  value 27K  [RESC1005X04N]  (hidden comment: R)
R203  value 250K  [RESC2012X06N]  (hidden comment: R)
R204  value 3K3  [RESC1005X04N]  (hidden comment: R)
R205  value 18K  [RESC1005X04N]  (hidden comment: R)
R206  value 2R2  [RESC2012X06N]  (hidden comment: R)
R207  value 2R2  [RESC2012X06N]  (hidden comment: R)
R208  value 2R2  [RESC2012X06N]  (hidden comment: R)
R209  value 2R2  [RESC2012X06N]  (hidden comment: R)
R210  value 2R2  [RESC2012X06N]  (hidden comment: R)
R211  value 2R2  [RESC2012X06N]  (hidden comment: R)
R212  value 22R  [RESC1005X04N]  (hidden comment: R)
R213  value 22R  [RESC1005X04N]  (hidden comment: R)

### Ports
A_COM (in, see Main_CPU[7C], Inverter[1B]), A_H (out, see Main_CPU[7C], Inverter[1B]), A_L (out, see Main_CPU[7C], Inverter[1B]), A_S_L (in, see Main_CPU[7C], Inverter[1B]), B_COM (in, see Main_CPU[7C], Inverter[8C]), B_H (out, see Main_CPU[7C], Inverter[8B]), B_L (out, see Main_CPU[7C], Inverter[8C]), B_S_L (in, see Main_CPU[7C], Inverter[8B]), C_COM (in, see Main_CPU[7D], Inverter[5D]), C_H (out, see Main_CPU[7D], Inverter[5D]), C_L (out, see Main_CPU[7D], Inverter[5D]), C_S_L (in, see Main_CPU[7D], Inverter[4D]), DC_CAL (in, see Main_CPU[7C]), EN_INV (in, see Main_CPU[7C]), Ia_OUT (out, see Main_CPU[7D]), Ib_OUT (out, see Main_CPU[7D]), INH_A (in, see Main_CPU[7C]), INH_B (in, see Main_CPU[7C]), INH_C (in, see Main_CPU[7C]), INL_A (in, see Main_CPU[7C]), INL_B (in, see Main_CPU[7C]), INL_C (in, see Main_CPU[7C]), nFAULT (out, see Main_CPU[7D]), nOCT_W (out, see Main_CPU[7D]), PD_A_O (out, see Main_CPU[7C]), PD_B_O (out, see Main_CPU[7C]), PD_C_O (out, see Main_CPU[7C]), PWRGD (out, see Main_CPU[7D]), S1_N (in, see Main_CPU[7D], Inverter[1B]), S1_P (in, see Main_CPU[7D], Inverter[1B]), S2_N (in, see Main_CPU[7D]), S2_P (in, see Main_CPU[7D]), SPI_DRV_CS (in, see Main_CPU[7C]), SPI_MISO (out, see Main_CPU[7C]), SPI_MOSI (in, see Main_CPU[7C]), SPI_SCK (in, see Main_CPU[7C])

### Nets
+5V: C220.1 IC203.2(VOUT) IC203.4(NC)
+7V5: C212.1(+) C213.2 C219.1 IC203.3(VIN) L201.2 R202.1
AVCC: IC202.24(REF)
DC_BUS: C201.2 C205.2 C206.2 C207.1 C208.2 C227.2 IC201.1(VBB) IC202.29(PVDD1) IC202.53(PVDD2_1) IC202.54(PVDD2_2)
GND: C203.1 C204.1 C205.1 C206.1 C207.2 C208.1 C210.1 C212.2(-) C213.1 C217.1 C219.2 C220.2 C221.1 C222.1 C223.1 C224.1 C227.1 D201.2(A) IC201.9(GND) IC201.17(EP) IC202.28(AGND) IC202.57(EP) IC203.1(GND/ADJ) R203.2 R204.1 R205.2
Vboost: C201.1 IC201.16(VCP)
VDD: IC202.49(VDD_SPI)
A_COM: C214.1 IC201.14(SU) IC202.46(SH_A) ; port A_COM
A_H: IC202.47(GH_A) R206.2
A_HIGH: R206.1 ; port A_H
A_L: IC202.45(GL_A) R207.2
A_LOW: R207.1 ; port A_L
A_S_L: IC202.44(SL_A) ; port A_S_L
ADC_Ia: C222.2 R212.2 ; port Ia_OUT
ADC_Ib: C221.2 R213.2 ; port Ib_OUT
B_COM: C216.1 IC201.12(SV) IC202.41(SH_B) ; port B_COM
B_H: IC202.42(GH_B) R208.2
B_HIGH: R208.1 ; port B_H
B_L: IC202.40(GL_B) R209.2
B_LOW: R209.1 ; port B_L
B_SRC_LOW: IC202.39(SL_B) ; port B_S_L
C_COM: C218.1 IC201.10(SW) IC202.36(SH_C) ; port C_COM
C_H: IC202.37(GH_C) R210.2
C_HIGH: R210.1 ; port C_H
C_L: IC202.35(GL_C) R211.2
C_LOW: R211.1 ; port C_L
C_SRC_LOW: IC202.34(SL_C) ; port C_S_L
DRV_DC_CAL: IC202.12(DC_CAL) ; port DC_CAL
DRV_nFLT: IC202.6(N_FAULT) ; port nFAULT
DRV_nOCTW: IC202.5(N_OCTW) ; port nOCT_W
DRV_PWRGD: IC202.4(PWRGD) ; port PWRGD
EN_INV: IC201.6(IG) IC201.7(POK) IC201.8(ENA) IC202.16(EN_GATE) ; port EN_INV
P_DISC_A: IC201.15(GU) ; port PD_A_O
P_DISC_C: IC201.11(GW) ; port PD_C_O
PDISC_B: IC201.13(GV) ; port PD_B_O
PWM_A_N: IC202.18(INL_A) ; port INL_A
PWM_A_P: IC202.17(INH_A) ; port INH_A
PWM_B_N: IC202.20(INL_B) ; port INL_B
PWM_B_P: IC202.19(INH_B) ; port INH_B
PWM_C_N: IC202.22(INL_C) ; port INL_C
PWM_C_P: IC202.21(INH_C) ; port INH_C
S1_N: C225.2 IC202.33(SN1) ; port S1_N
S1_P: C225.1 IC202.32(SP1) ; port S1_P
S2_N: C226.1 IC202.30(SP2) ; port S2_P
S2_P: C226.2 IC202.31(SN2) ; port S2_N
SPI_MISO: IC202.10(SDO) ; port SPI_MISO
SPI_MOSI: IC202.9(SDI) ; port SPI_MOSI
SPI_SCK: IC202.11(SCLK) ; port SPI_SCK
SPI_SS1: IC202.8(N_SCS) ; port SPI_DRV_CS
NetC202_1: C202.1 IC201.2(CP4)
NetC202_2: C202.2 IC201.3(CP3)
NetC203_2: C203.2 IC202.2(COMP) R201.2
NetC204_2: C204.2 R201.1
NetC209_1: C209.1 IC201.4(CP2)
NetC209_2: C209.2 IC201.5(CP1)
NetC210_2: C210.2 IC202.56(SS_TR)
NetC211_1: C211.1 D201.1(K) IC202.50(PH_1) IC202.51(PH_2) L201.1
NetC211_2: C211.2 IC202.52(BST_BK)
NetC214_2: C214.2 IC202.48(BST_A)
NetC215_1: C215.1 IC202.14(CP1)
NetC215_2: C215.2 IC202.15(CP2)
NetC216_2: C216.2 IC202.43(BST_B)
NetC217_2: C217.2 IC202.13(GVDD)
NetC218_2: C218.2 IC202.38(BST_C)
NetC223_2: C223.2 IC202.23(DVDD)
NetC224_2: C224.2 IC202.27(AVDD)
NetIC202_1: IC202.1(RT_CLK) R203.1
NetIC202_3: IC202.3(VSENSE) R202.2 R204.2
NetIC202_7: IC202.7(DTC) R205.1
NetIC202_25: IC202.25(SO1) R212.1
NetIC202_26: IC202.26(SO2) R213.1

Not connected (* = marked no-connect by the designer): IC202 55(EN_BUCK)

### Library data of the parts
C201 = Cap: Capacitor; MPN: GRM155Z71A105KE01D; Link: https://jlcpcb.com/partdetail/548880-GRM155Z71A105KE01D/C528974; Price: 0.0206
C202 C209 C219 C220 = Cap: Capacitor; MPN: 0402B334K160NT; Link: https://jlcpcb.com/partdetail/287763-0402B334K160NT/C301942; Price: 0.015
C203 = Cap: Capacitor; MPN: CC0402JRNPO9BN820; Link: https://jlcpcb.com/partdetail/Yageo-CC0402JRNPO9BN820/C107011; Price: 0.001
C204 = Cap: Capacitor; MPN: CC0402KRX7R9BB271; Link: https://jlcpcb.com/partdetail/Yageo-CC0402KRX7R9BB271/C107027; Price: 0.001
C205 C206 C213 = Cap: Capacitor; MPN: CC1210KKX7R8BB475; Link: https://www.lcsc.com/product-detail/Multilayer-Ceramic-Capacitors-MLCC-SMD-SMT_YAGEO-CC1210KKX7R8BB475_C2980104.html; Price: 0.1519
C207 C208 C211 C214 C216 C218 = Cap: Capacitor; MPN: GCM155R71H104KE02D; Link: https://jlcpcb.com/partdetail/MurataElectronics-GCM155R71H104KE02D/C85858; Price: 0.0031
C210 = Cap: Capacitor; MPN: GRM155R71E153KA61D; Link: https://jlcpcb.com/partdetail/MurataElectronics-GRM155R71E153KA61D/C97869; Price: 0.0043
C212 = EEE-FT1E680AR: Capacitor Polarised; Manufacturer_Name: Panasonic; Datasheet Link: http://industrial.panasonic.com/cdbs/www-data/pdf/RDE0000/ABA0000C1240.pdf; Height: 6.5mm; MPN: EEE-FT1E680AR; Mouser Part Number: 667-EEE-FT1E680AR; Mouser Price/Stock: https://www.mouser.co.uk/ProductDetail/Panasonic/EEE-FT1E680AR?qs=CMJjuEs1%252BuEkcyWhjLG4NQ%3D%3D; Link: https://www.lcsc.com/product-detail/Aluminum-Electrolytic-Capacitors-SMD_PANASONIC-EEEFT1E680AR_C178592.html; Price: 0.1901
C215 = Cap: Capacitor; MPN: CC0603JRX7R8BB223; Link: https://www.lcsc.com/product-detail/Multilayer-Ceramic-Capacitors-MLCC-SMD-SMT_YAGEO-CC0603JRX7R8BB223_C327290.html; Price: 0.008
C217 C223 C224 = Cap: Capacitor; MPN: GRM155Z71A225KE44D; Link: https://jlcpcb.com/partdetail/3478404-GRM155Z71A225KE44D/C2999759; Price: 0.0332
C221 C222 C225 C226 = Cap: Capacitor; MPN: CC0402KRX7R7BB222; Link: https://jlcpcb.com/partdetail/Yageo-CC0402KRX7R7BB222/C541376; Price: 0.001
C227 = Cap: Capacitor; MPN: GCM155R71C683KA55D; Link: https://jlcpcb.com/partdetail/172547-GCM155R71C683KA55D/C161166; Price: 0.0075
D201 = MBR140SFT3G: Diode; Manufacturer_Name: onsemi; MPN: LMBR140FT1G; Datasheet Link: https://componentsearchengine.com/Datasheets/2/MBR140SFT3G.pdf; Height: 0.98mm; Manufacturer_Part_Number: MBR140SFT3G; Mouser Price/Stock: https://www.mouser.co.uk/ProductDetail/onsemi/MBR140SFT3G?qs=3JMERSakebocVlQyvh5H6Q%3D%3D; Arrow Part Number: MBR140SFT3G; Arrow Price/Stock: https://www.arrow.com/en/products/mbr140sft3g/on-semiconductor?region=nac; Link: https://www.lcsc.com/product-detail/Schottky-Diodes_LRC-LMBR140FT1G_C131782.html; Price: 0.0234
IC201 = A6861-A6862: Integrated Circuit; Manufacturer_Name: Allegro Microsystems; MPN: A6862KLPTR-T; Datasheet Link: https://www.allegromicro.com/-/media/files/datasheets/a6862-datasheet.pdf; Height: 1.2mm; Link: https://www.lcsc.com/product-detail/Gate-Drivers_Allegro-MicroSystems-LLC-A6862KLPTR-T_C2677085.html; Price: 2.8803
IC202 = DRV8301DCAR: Integrated Circuit; Manufacturer_Name: Texas Instruments; Datasheet Link: http://www.ti.com/lit/gpn/drv8301; Height: 1.2mm; Mouser Part Number: 595-DRV8301DCAR; Mouser Price/Stock: https://www.mouser.co.uk/ProductDetail/Texas-Instruments/DRV8301DCAR?qs=SMj%252Bbyv09TwYHebRFanjcw%3D%3D; Arrow Part Number: DRV8301DCAR; Arrow Price/Stock: null?region=nac; MPN: DRV8301DCAR; Link: https://jlcpcb.com/partdetail/TexasInstruments-DRV8301DCAR/C98969; Price: 2.4675
IC203 = AMS1117-3.3: Integrated Circuit; Manufacturer_Name: Advanced; MPN: LM1117IMPX-5.0/NOPB; Datasheet Link: https://datasheet.datasheetarchive.com/originals/distributors/Datasheets-28/DSA-550594.pdf; Height: 1.8mm; Link: https://www.lcsc.com/product-detail/Voltage-Regulators-Linear-Low-Drop-Out-LDO-Regulators_Texas-Instruments-LM1117IMPX-5-0-NOPB_C41202.html?s_z=n_LM1117; Price: 0.31
L201 = L: MPN: XRNR6028-22uH/M; Link: https://www.lcsc.com/product-detail/Power-Inductors_XR-XRNR6028-22uH-M_C5339730.html; Price: 0.0521
R201 = R: Resistor; MPN: RC0402FR-0747KL; Link: https://jlcpcb.com/partdetail/Yageo-RC0402FR0747KL/C93943; Price: 0.0006
R202 = R: Resistor; MPN: RC0402FR-0727KL; Link: https://jlcpcb.com/partdetail/Yageo-RC0402FR0727KL/C138022; Price: 0.0006
R203 = R: Resistor; MPN: ARG05FTC2503N; Link: https://www.lcsc.com/product-detail/Chip-Resistor-Surface-Mount_Viking-Tech-ARG05FTC2503N_C5156563.html; Price: 0.0081
R204 = R: Resistor; MPN: RC0402FR-073K3L; Link: https://jlcpcb.com/partdetail/Yageo-RC0402FR073K3L/C137992; Price: 0.0006
R205 = R: Resistor; MPN: RC0402FR-0718KL; Link: https://jlcpcb.com/partdetail/Yageo-RC0402FR0718KL/C138044; Price: 0.0006
R206-R211 = R: Resistor; MPN: RC0402FR-072R2L; Link: https://www.lcsc.com/product-detail/Chip-Resistor-Surface-Mount_YAGEO-RC0402FR-072R2L_C327251.html; Price: 0.0016
R212 R213 = R: Resistor; MPN: RC0402FR-0722RL; Link: https://jlcpcb.com/partdetail/Yageo-RC0402FR0722RL/C114765; Price: 0.0006

## Sheet Inverter.SchDoc
size A3; SheetNumber: 2; SheetTotal: 5
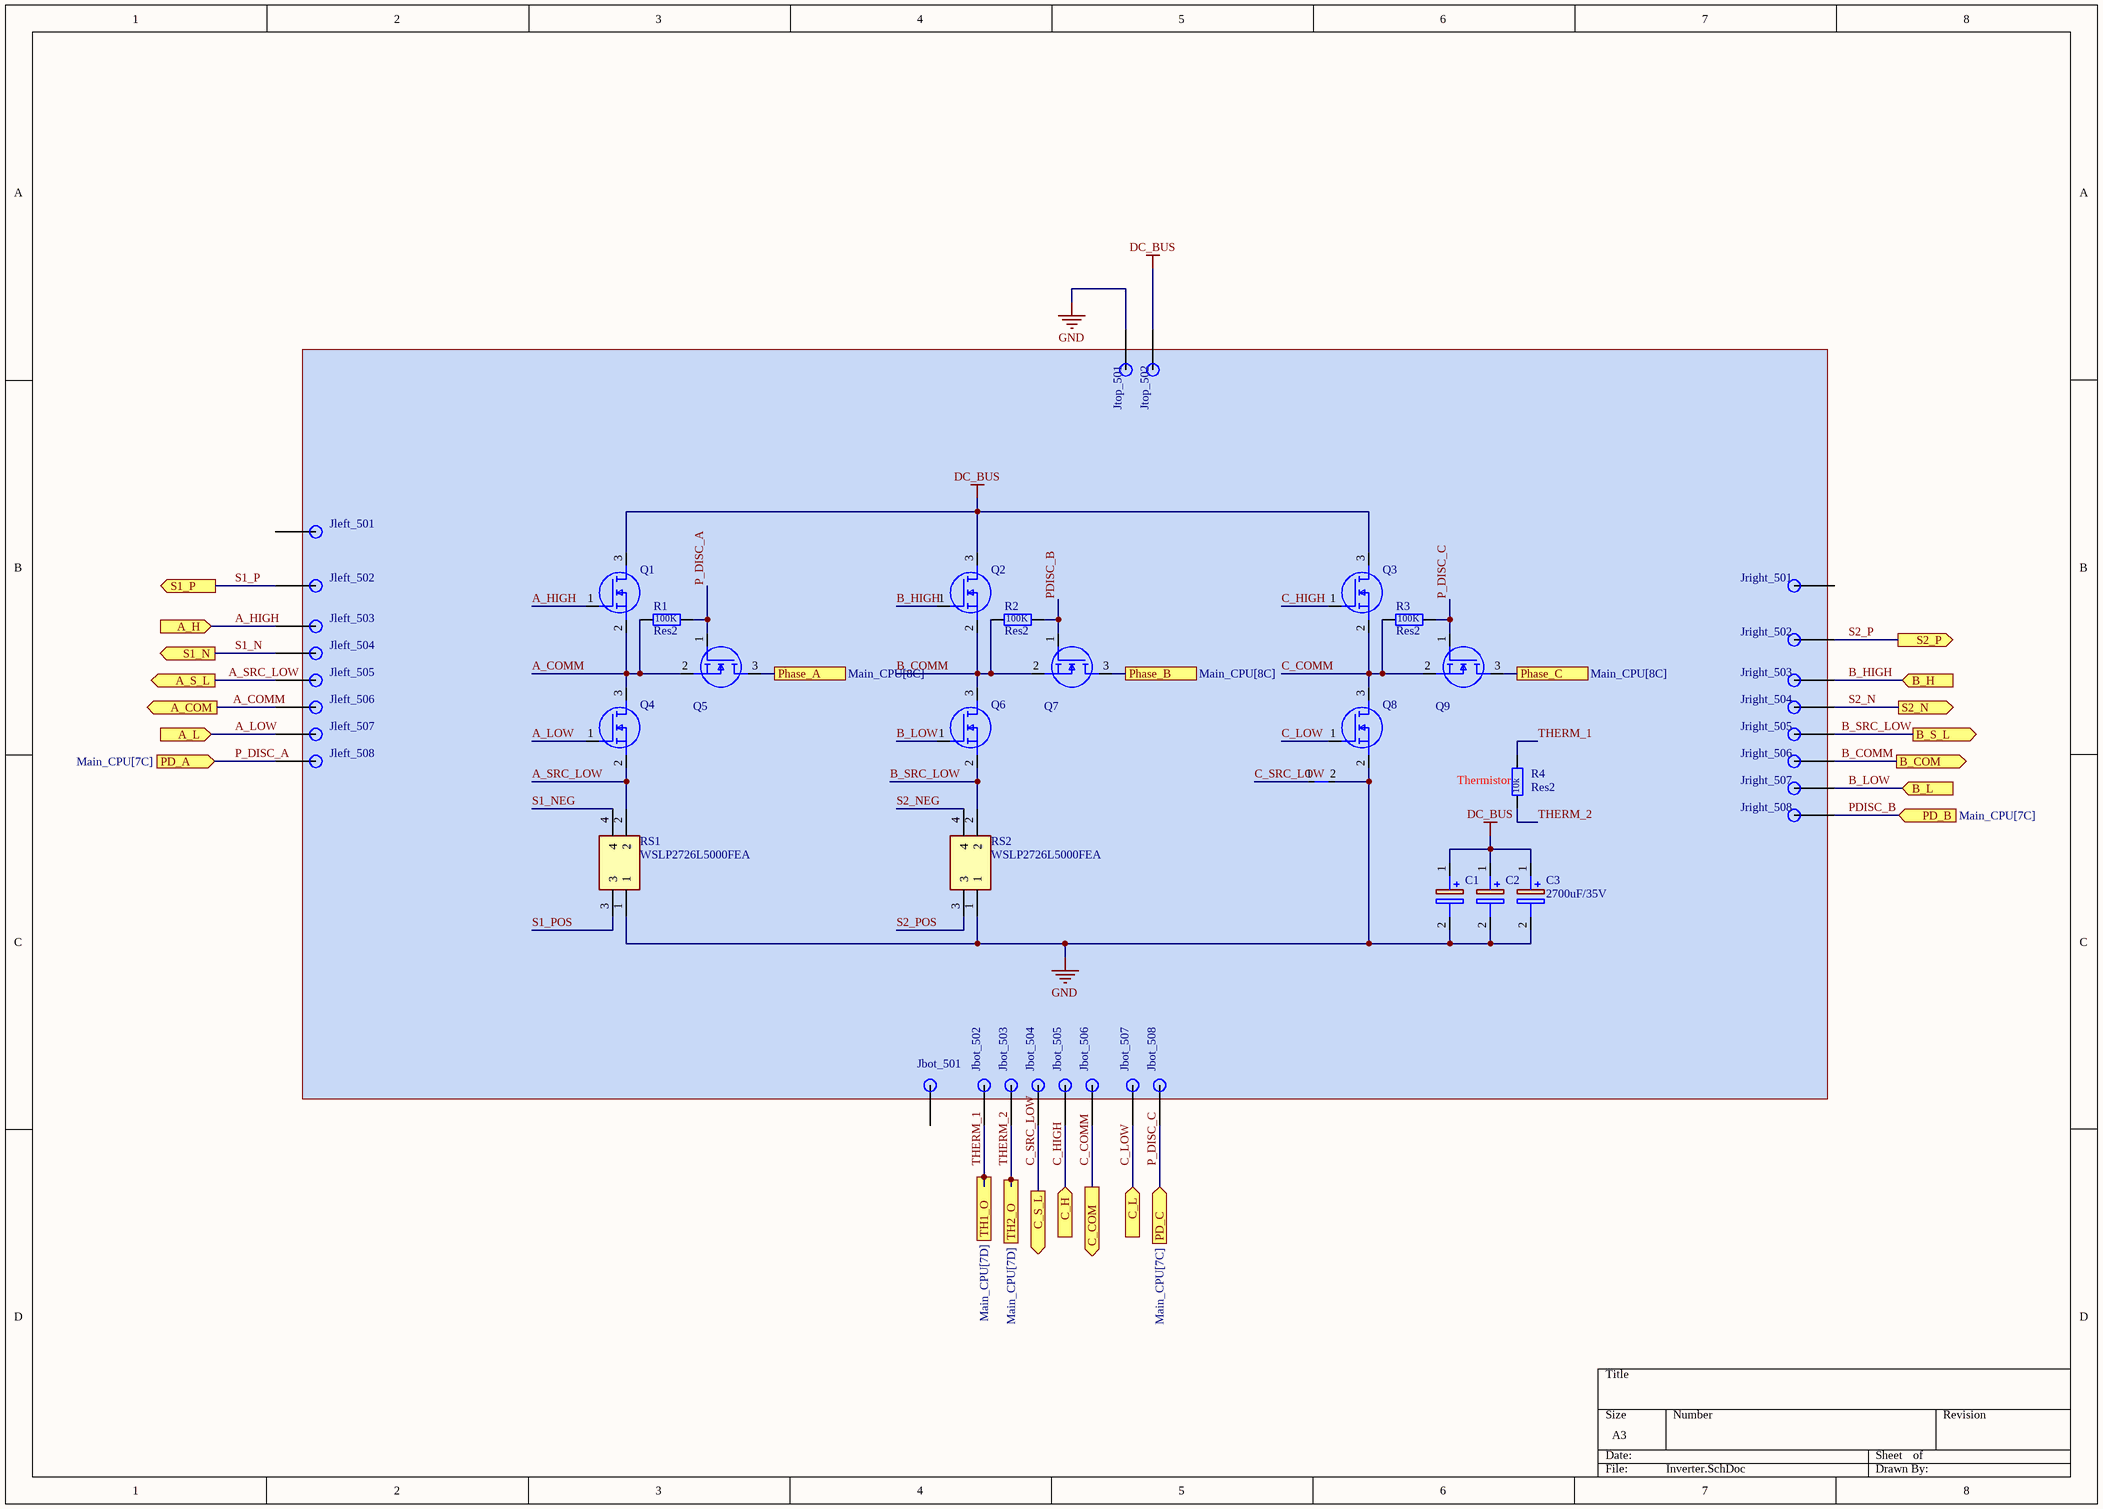
[diagram p2: Inverter.SchDoc]

### Parts
C1  2700uF/35V  [CAPPM6032X280N]  (value not drawn)  (graphical)
C2  2700uF/35V  [CAPPM6032X280N]  (value not drawn)  (graphical)
C3  2700uF/35V  [CAPPM6032X280N]  (graphical)
Jbot_501  Pin_1mm  [Pin_1.5mm]  (value not drawn)  (no BOM)
Jbot_502  Pin_1mm  [Pin_1mm]  (value not drawn)  (no BOM)
Jbot_503  Pin_1mm  [Pin_1mm]  (value not drawn)  (no BOM)
Jbot_504  Pin_1mm  [Pin_1mm]  (value not drawn)  (no BOM)
Jbot_505  Pin_1mm  [Pin_1mm]  (value not drawn)  (no BOM)
Jbot_506  Pin_1mm  [Pin_1mm]  (value not drawn)  (no BOM)
Jbot_507  Pin_1mm  [Pin_1mm]  (value not drawn)  (no BOM)
Jbot_508  Pin_1mm  [Pin_1mm]  (value not drawn)  (no BOM)
Jleft_501  Pin_1mm  [Pin_1.5mm]  (value not drawn)  (no BOM)
Jleft_502  Pin_1mm  [Pin_1mm]  (value not drawn)  (no BOM)
Jleft_503  Pin_1mm  [Pin_1mm]  (value not drawn)  (no BOM)
Jleft_504  Pin_1mm  [Pin_1mm]  (value not drawn)  (no BOM)
Jleft_505  Pin_1mm  [Pin_1mm]  (value not drawn)  (no BOM)
Jleft_506  Pin_1mm  [Pin_1mm]  (value not drawn)  (no BOM)
Jleft_507  Pin_1mm  [Pin_1mm]  (value not drawn)  (no BOM)
Jleft_508  Pin_1mm  [Pin_1mm]  (value not drawn)  (no BOM)
Jright_501  Pin_1mm  [Pin_1.5mm]  (value not drawn)  (no BOM)
Jright_502  Pin_1mm  [Pin_1mm]  (value not drawn)  (no BOM)
Jright_503  Pin_1mm  [Pin_1mm]  (value not drawn)  (no BOM)
Jright_504  Pin_1mm  [Pin_1mm]  (value not drawn)  (no BOM)
Jright_505  Pin_1mm  [Pin_1mm]  (value not drawn)  (no BOM)
Jright_506  Pin_1mm  [Pin_1mm]  (value not drawn)  (no BOM)
Jright_507  Pin_1mm  [Pin_1mm]  (value not drawn)  (no BOM)
Jright_508  Pin_1mm  [Pin_1mm]  (value not drawn)  (no BOM)
Jtop_501  Pin_1mm  [Pin_1mm]  (value not drawn)  (no BOM)
Jtop_502  Pin_1mm  [Pin_1mm]  (value not drawn)  (no BOM)
NT501  Net_Tie  [Net_Tie_SMD]  (value not drawn)  (net tie, no BOM)
Q1  IPT010N08NM5ATMA1  [IPT010N08NM5ATMA1]  (value not drawn)  (graphical)
Q2  IPT010N08NM5ATMA1  [IPT010N08NM5ATMA1]  (value not drawn)  (graphical)
Q3  IPT010N08NM5ATMA1  [IPT010N08NM5ATMA1]  (value not drawn)  (graphical)
Q4  IPT010N08NM5ATMA1  [IPT010N08NM5ATMA1]  (value not drawn)  (graphical)
Q5  IPT010N08NM5ATMA1  [IPT010N08NM5ATMA1]  (value not drawn)  (graphical)
Q6  IPT010N08NM5ATMA1  [IPT010N08NM5ATMA1]  (value not drawn)  (graphical)
Q7  IPT010N08NM5ATMA1  [IPT010N08NM5ATMA1]  (value not drawn)  (graphical)
Q8  IPT010N08NM5ATMA1  [IPT010N08NM5ATMA1]  (value not drawn)  (graphical)
Q9  IPT010N08NM5ATMA1  [IPT010N08NM5ATMA1]  (value not drawn)  (graphical)
R1  Res2  value 100K  [AXIAL-0.4]  (graphical)
R2  Res2  value 100K  [AXIAL-0.4]  (graphical)
R3  Res2  value 100K  [AXIAL-0.4]  (graphical)
R4  Res2  value 10k  [AXIAL-0.4]  (graphical)
RS1  WSLP2726L5000FEA  [WSL27261L000FEA]  (graphical)
RS2  WSLP2726L5000FEA  [WSL27261L000FEA]  (graphical)

### Blocks framed on the sheet
Thermistor: C1-C3 Jbot_501-Jbot_508 Jleft_501-Jleft_508 Jright_501-Jright_508 Jtop_501 Jtop_502 NT501 Q1-Q9 R1-R4 RS1 RS2

### Ports
A_COM (out, see Main_CPU[7C], Gate_Driver[2B]), A_H (in, see Main_CPU[7C], Gate_Driver[2B]), A_L (in, see Main_CPU[7C], Gate_Driver[2B]), A_S_L (out, see Main_CPU[7C], Gate_Driver[2B]), B_COM (out, see Main_CPU[7C], Gate_Driver[2B]), B_H (in, see Main_CPU[7C], Gate_Driver[2B]), B_L (in, see Main_CPU[7C], Gate_Driver[2B]), B_S_L (out, see Main_CPU[7C], Gate_Driver[2C]), C_COM (out, see Main_CPU[7D], Gate_Driver[2C]), C_H (in, see Main_CPU[7D], Gate_Driver[2C]), C_L (in, see Main_CPU[7D], Gate_Driver[2C]), C_S_L (out, see Main_CPU[7D], Gate_Driver[2C]), PD_A (in, see Main_CPU[7C]), PD_B (in, see Main_CPU[7C]), PD_C (in, see Main_CPU[7C]), Phase_A (see Main_CPU[8C]), Phase_B (see Main_CPU[8C]), Phase_C (see Main_CPU[8C]), S1_N (out, see Main_CPU[7D], Gate_Driver[2C]), S1_P (out, see Main_CPU[7D], Gate_Driver[2C]), S2_N (out, see Main_CPU[7D]), S2_P (out, see Main_CPU[7D]), TH1_O (out, see Main_CPU[7D]), TH2_O (out, see Main_CPU[7D])

### Nets
DC_BUS: C1.1(+) C2.1(+) C3.1(+) Jtop_502.1 Q1.3(D) Q2.3(D) Q3.3(D)
GND: C1.2(-) C2.2(-) C3.2(-) Jtop_501.1 NT501.2 Q8.2(S) RS1.1 RS2.1
A_COMM: Jleft_506.1 Q1.2(S) Q4.3(D) Q5.2(S) R1.1 ; port A_COM  [project net A_COM]
A_HIGH: Jleft_503.1 Q1.1(G) ; port A_H
A_LOW: Jleft_507.1 Q4.1(G) ; port A_L
A_SRC_LOW: Jleft_505.1 Q4.2(S) RS1.2 ; port A_S_L  [project net A_S_L]
B_COMM: Jright_506.1 Q2.2(S) Q6.3(D) Q7.2(S) R2.1 ; port B_COM  [project net B_COM]
B_HIGH: Jright_503.1 Q2.1(G) ; port B_H
B_LOW: Jright_507.1 Q6.1(G) ; port B_L
B_SRC_LOW: Jright_505.1 Q6.2(S) RS2.2 ; port B_S_L
C_COMM: Jbot_506.1 Q3.2(S) Q8.3(D) Q9.2(S) R3.1 ; port C_COM  [project net C_COM]
C_HIGH: Jbot_505.1 Q3.1(G) ; port C_H
C_LOW: Jbot_507.1 Q8.1(G) ; port C_L
C_SRC_LOW: Jbot_504.1 NT501.1 ; port C_S_L
P_DISC_A: Jleft_508.1 Q5.1(G) R1.2 ; port PD_A
P_DISC_C: Jbot_508.1 Q9.1(G) R3.2 ; port PD_C
PDISC_B: Jright_508.1 Q7.1(G) R2.2 ; port PD_B
S1_N: Jleft_504.1 ; port S1_N
S1_NEG: RS1.4
S1_P: Jleft_502.1 ; port S1_P
S1_POS: RS1.3
S2_N: Jright_504.1 ; port S2_N
S2_NEG: RS2.4
S2_P: Jright_502.1 ; port S2_P
S2_POS: RS2.3
THERM_1: Jbot_502.1 R4.2 ; port TH1_O  [project net TH1]
THERM_2: Jbot_503.1 R4.1 ; port TH2_O  [project net ADC_Inv_Temp]
NetQ5_3: Q5.3(D) ; port Phase_A
NetQ7_3: Q7.3(D) ; port Phase_B
NetQ9_3: Q9.3(D) ; port Phase_C

Not connected (* = marked no-connect by the designer): Jbot_501 1; Jleft_501 1; Jright_501 1

### Library data of the parts
C1-C3 = 293D106X9025C2TE3: Capacitor Polarised; Manufacturer_Name: Vishay; Datasheet Link: http://www.vishay.com/docs/40002/293d.pdf; Height: 2.8mm; Manufacturer_Part_Number: 293D106X9025C2TE3; Mouser Part Number: 74-293D106X9025C2TE3; Mouser Price/Stock: https://www.mouser.co.uk/ProductDetail/Vishay-Sprague/293D106X9025C2TE3?qs=N31o%252Bt096gtaEBFlCxpfFQ%3D%3D; Arrow Part Number: 293D106X9025C2TE3; Arrow Price/Stock: https://www.arrow.com/en/products/293d106x9025c2te3/vishay?region=nac
Jbot_501-Jbot_508 Jleft_501-Jleft_508 Jright_501-Jright_508 Jtop_501 Jtop_502 = Pin_1mm: Pin_Connector; MPN: X5511FV-02-C70D30-1000; Link: https://www.lcsc.com/product-detail/Female-Headers_XKB-Connection-X5511FV-02-C70D30-1000_C2684752.html; Price: 0.0742
NT501 = Net_Tie: Net Tie
Q1-Q9 = IPT010N08NM5ATMA1: MOSFET (N-Channel); Manufacturer_Name: Infineon; Datasheet Link: https://www.infineon.com/dgdl/Infineon-IPT010N08NM5-DataSheet-v02_00-EN.pdf?fileId=5546d462766cbe860176761d659d581e; Height: 2.4mm; MPN: IPT010N08NM5ATMA1; Mouser Part Number: 726-IPT010N08NM5ATM1; Mouser Price/Stock: https://www.mouser.co.uk/ProductDetail/Infineon-Technologies/IPT010N08NM5ATMA1?qs=DRkmTr78QARZBVXV%252BQr%2FqA%3D%3D
R1-R4 = Res2: Resistor; Published: 8-Jun-2000; LatestRevisionDate: 17-Jul-2002; LatestRevisionNote: Re-released for DXP Platform.; PackageReference: AXIAL-0.4; Publisher: Altium Limited; PackageDescription: Axial Device, Thru-Hole; 2 Leads; 0.4 in Pin Spacing
RS1 RS2 = WSLP2726L5000FEA: Resistor; Manufacturer_Name: Vishay; Datasheet Link: https://www.vishay.com/docs/30179/wslp2726.pdf; Height: 2mm; Manufacturer_Part_Number: WSLP2726L5000FEA; Mouser Part Number: 71-WSLP2726L5000FEA; Mouser Price/Stock: https://www.mouser.co.uk/ProductDetail/Vishay-Dale/WSLP2726L5000FEA?qs=H%252BW4FWGGyHeDwweg1TYd4Q%3D%3D; Arrow Part Number: WSLP2726L5000FEA; Arrow Price/Stock: https://www.arrow.com/en/products/wslp2726l5000fea/vishay?region=nac

## Sheet Dig_Encoder_Interface.SchDoc
size A; SheetNumber: 5; SheetTotal: 5
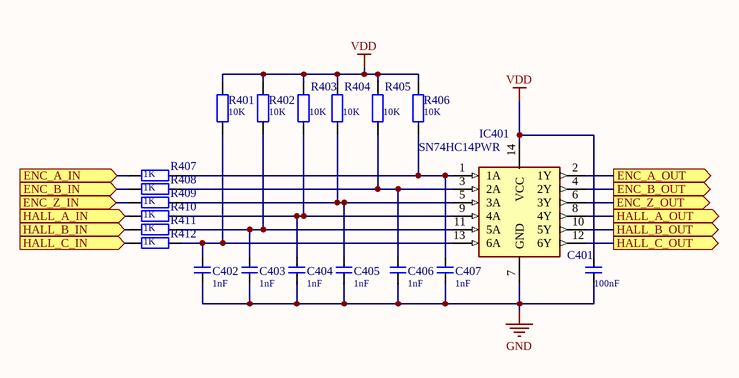
[diagram p3: Dig_Encoder_Interface.SchDoc]

### Parts
C401  value 100nF  [CAPC1005X06N]  (hidden comment: Cap)
C402  value 1nF  [CAPC1005X06N]  (hidden comment: Cap)
C403  value 1nF  [CAPC1005X06N]  (hidden comment: Cap)
C404  value 1nF  [CAPC1005X06N]  (hidden comment: Cap)
C405  value 1nF  [CAPC1005X06N]  (hidden comment: Cap)
C406  value 1nF  [CAPC1005X06N]  (hidden comment: Cap)
C407  value 1nF  [CAPC1005X06N]  (hidden comment: Cap)
IC401  SN74HC14PWR  [SOP65P640X120-14N]
R401  value 10K  [RESC1005X04N]  (hidden comment: R)
R402  value 10K  [RESC1005X04N]  (hidden comment: R)
R403  value 10K  [RESC1005X04N]  (hidden comment: R)
R404  value 10K  [RESC1005X04N]  (hidden comment: R)
R405  value 10K  [RESC1005X04N]  (hidden comment: R)
R406  value 10K  [RESC1005X04N]  (hidden comment: R)
R407  value 1K  [RESC1005X04N]  (hidden comment: R)
R408  value 1K  [RESC1005X04N]  (hidden comment: R)
R409  value 1K  [RESC1005X04N]  (hidden comment: R)
R410  value 1K  [RESC1005X04N]  (hidden comment: R)
R411  value 1K  [RESC1005X04N]  (hidden comment: R)
R412  value 1K  [RESC1005X04N]  (hidden comment: R)

### Ports
ENC_A_IN (in, see Main_CPU[4B]), ENC_A_OUT (out, see Main_CPU[5B]), ENC_B_IN (in, see Main_CPU[4B]), ENC_B_OUT (out, see Main_CPU[5B]), ENC_Z_IN (in, see Main_CPU[4B]), ENC_Z_OUT (out, see Main_CPU[5B]), HALL_A_IN (in, see Main_CPU[4C]), HALL_A_OUT (out, see Main_CPU[5C]), HALL_B_IN (in, see Main_CPU[4C]), HALL_B_OUT (out, see Main_CPU[5C]), HALL_C_IN (in, see Main_CPU[4C]), HALL_C_OUT (out, see Main_CPU[5C])

### Nets
GND: C401.1 C402.1 C403.1 C404.1 C405.1 C406.1 C407.1 IC401.7(GND)
VDD: C401.2 IC401.14(VCC) R401.2 R402.2 R403.2 R404.2 R405.2 R406.2
ENC_A: IC401.2(1Y) ; port ENC_A_OUT
ENC_B: IC401.4(2Y) ; port ENC_B_OUT
HALL_A: IC401.8(4Y) ; port HALL_A_OUT
HALL_B: IC401.10(5Y) ; port HALL_B_OUT
HALL_C: IC401.12(6Y) ; port HALL_C_OUT
PWM_IN_ENC_Z: IC401.6(3Y) ; port ENC_Z_OUT
NetC402_2: C402.2 IC401.13(6A) R401.1 R412.1
NetC403_2: C403.2 IC401.11(5A) R402.1 R411.1
NetC404_2: C404.2 IC401.9(4A) R403.1 R410.1
NetC405_2: C405.2 IC401.5(3A) R404.1 R409.1
NetC406_2: C406.2 IC401.3(2A) R405.1 R408.1
NetC407_2: C407.2 IC401.1(1A) R406.1 R407.1
NetJ109_2: R407.2 ; port ENC_A_IN
NetJ109_3: R408.2 ; port ENC_B_IN
NetJ109_4: R409.2 ; port ENC_Z_IN
NetJ109_5: R410.2 ; port HALL_A_IN
NetJ109_6: R411.2 ; port HALL_B_IN
NetJ109_7: R412.2 ; port HALL_C_IN

### Library data of the parts
C401 = Cap: Capacitor; MPN: GCM155R71H104KE02D; Link: https://jlcpcb.com/partdetail/MurataElectronics-GCM155R71H104KE02D/C85858; Price: 0.0031
C402-C407 = Cap: Capacitor; MPN: GRM155R71H102KA01D; Link: https://jlcpcb.com/partdetail/MurataElectronics-GRM155R71H102KA01D/C77018; Price: 0.0016
IC401 = SN74HC14PWR: Integrated Circuit; Manufacturer_Name: Texas Instruments; Datasheet Link: http://www.ti.com/general/docs/suppproductinfo.tsp?distId=10&gotoUrl=http%3A%2F%2Fwww.ti.com%2Flit%2Fgpn%2Fsn74hc14; Height: 1.2mm; MPN: SN74HC14PWR; Mouser Part Number: 595-SN74HC14PWR; Mouser Price/Stock: https://www.mouser.co.uk/ProductDetail/Texas-Instruments/SN74HC14PWR?qs=YEaxc5757jODQ8PDizZzPA%3D%3D; Arrow Part Number: SN74HC14PWR; Arrow Price/Stock: https://www.arrow.com/en/products/sn74hc14pwr/texas-instruments?region=nac; Link: https://jlcpcb.com/partdetail/TexasInstruments-SN74HC14PWR/C6821; Price: 0.1209
R401-R406 = R: Resistor; MPN: RC0402FR-0710KL; Link: https://jlcpcb.com/partdetail/Yageo-RC0402FR0710KL/C60490; Price: 0.0005
R407-R412 = R: Resistor; MPN: RC0402FR-071KL; Link: RC0402FR-071KL; Price: 0.0006